# EAGLE design game board (EAGLE 7.2.0)
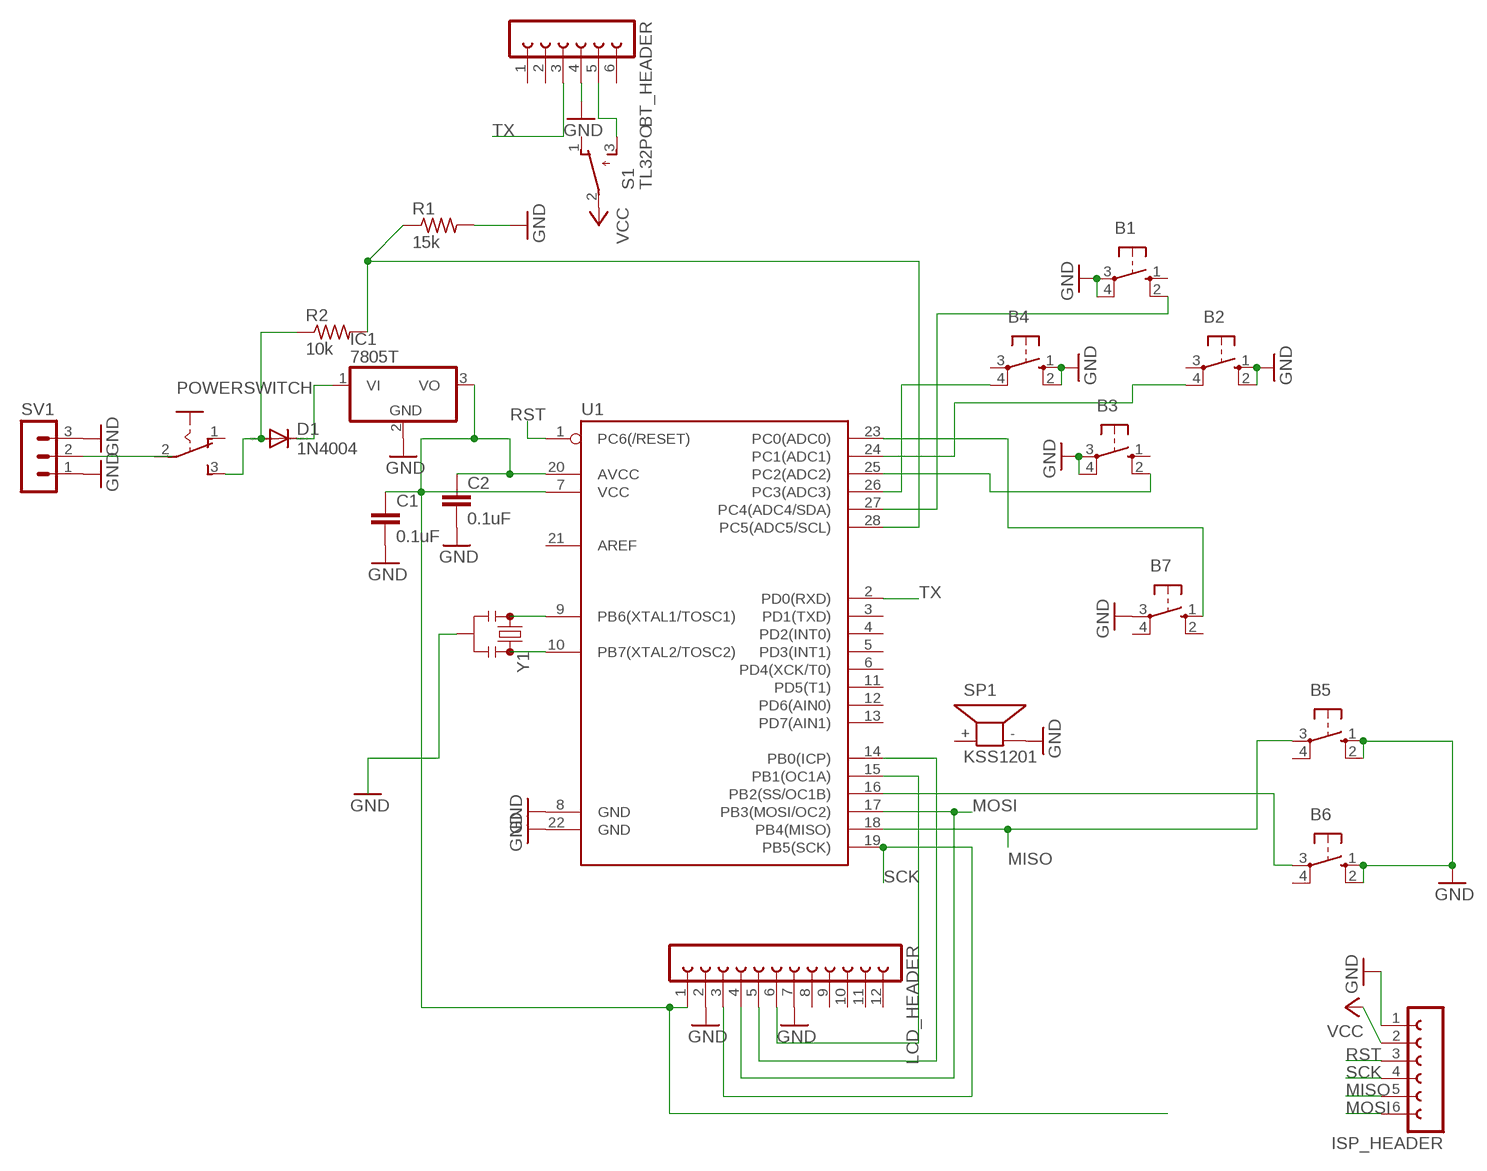
[diagram p0: schematic, sheet 1]

## Parts
B1  10-XX  [B3F-10XX]
B2  10-XX  [B3F-10XX]
B3  10-XX  [B3F-10XX]
B4  10-XX  [B3F-10XX]
B5  10-XX  [B3F-10XX]
B6  10-XX  [B3F-10XX]
B7  10-XX  [B3F-10XX]
BT_HEADER  FE06W  [FE06W]
C1  0.1uF  0.1UF-25V(+80/-20%)(0603)  [0603-CAP]
C2  0.1uF  0.1UF-25V(+80/-20%)(0603)  [0603-CAP]
D1  1N4004  [DO41-10]
IC1  7805T  [TO220H]
ISP_HEADER  FE06W  [FE06W]
LCD_HEADER  FE12W  [FE12W]
POWERSWITCH  M251  [M251]
R1  15k  R-US_0204/7  [0204/7]
R2  10k  R-US_0204/7  [0204/7]
S1  TL32PO  [TL3XPO]
SP1  KSS1201  [KSS1201]
SV1  MA03-1  [MA03-1]
U1  ATMEGA328P_PDIP  [DIL28-3]
Y1  RESONATORPTH  [RESONATOR-PTH]

## Nets
GND: B1.3(P) B1.4(P1) B2.1(S) B2.2(S1) B3.3(P) B3.4(P1) B4.1(S) B4.2(S1) B5.1(S) B5.2(S1) B6.1(S) B6.2(S1) B7.3(P) BT_HEADER.4 C1.2 C2.2 IC1.2(GND) ISP_HEADER.1 LCD_HEADER.2 LCD_HEADER.7 R1.2 SP1.- SV1.1 SV1.3 U1.8(GND) U1.22(GND) Y1.2
MISO: B5.3(P) ISP_HEADER.5 U1.18(PB4(MISO))
MOSI: ISP_HEADER.6 LCD_HEADER.4 U1.17(PB3(MOSI/OC2))
N$1: D1.C IC1.1(VI)
N$2: D1.A POWERSWITCH.3(S) R2.1
N$3: R1.1 R2.2 U1.28(PC5(ADC5/SCL))
N$4: B7.1(S) U1.23(PC0(ADC0))
N$5: B6.3(P) U1.16(PB2(SS/OC1B))
N$6: BT_HEADER.5 S1.3(S)
N$7: LCD_HEADER.5 U1.14(PB0(ICP))
N$8: B1.2(S1) U1.27(PC4(ADC4/SDA))
N$9: U1.9(PB6(XTAL1/TOSC1)) Y1.1
N$10: U1.10(PB7(XTAL2/TOSC2)) Y1.3
N$11: B2.4(P1) U1.24(PC1(ADC1))
N$12: B3.2(S1) U1.25(PC2(ADC2))
N$13: POWERSWITCH.2(P) SV1.2
N$14: LCD_HEADER.6 U1.15(PB1(OC1A))
N$15: B4.4(P1) U1.26(PC3(ADC3))
N$21: C1.1 C2.1 IC1.3(VO) LCD_HEADER.1 U1.7(VCC) U1.20(AVCC)
RST: ISP_HEADER.3 U1.1(PC6(/RESET))
SCK: ISP_HEADER.4 LCD_HEADER.3 U1.19(PB5(SCK))
TX: BT_HEADER.3 U1.2(PD0(RXD))
VCC: ISP_HEADER.2 S1.2(P)
Unconnected: B1.1(S) B2.3(P) B3.1(S) B4.3(P) B5.4(P1) B6.4(P1) B7.2(S1) B7.4(P1) BT_HEADER.1 BT_HEADER.2 BT_HEADER.6 LCD_HEADER.8 LCD_HEADER.9 LCD_HEADER.10 LCD_HEADER.11 LCD_HEADER.12 POWERSWITCH.1(O) S1.1(O) SP1.+ U1.3(PD1(TXD)) U1.4(PD2(INT0)) U1.5(PD3(INT1)) U1.6(PD4(XCK/T0)) U1.11(PD5(T1)) U1.12(PD6(AIN0)) U1.13(PD7(AIN1)) U1.21(AREF)

## Library data of the parts
B1-B7 = switch-omron:10-XX: OMRON SWITCH; MPN: B3F-1000; OC_FARNELL: 176432; OC_NEWARK: 36M3542
BT_HEADER ISP_HEADER = con-lsta:FE06W: FEMALE HEADER; OC_FARNELL: unknown; OC_NEWARK: unknown
C1 C2 = SparkFun-Capacitors:0.1UF-25V(+80/-20%)(0603): CAP-00810 Ceramic Standard decoupling cap; PROD_ID: CAP-00810
D1 = diode:1N4004: DIODE general purpose rectifier, 1 A
IC1 = linear:78*: Positive VOLTAGE REGULATOR Source: http://cache.national.com/ds/LM/LM78L05.pdf http://www.fairchildsemi.com/ds/LM/LM7805.pdf
LCD_HEADER = con-lsta:FE12W: FEMALE HEADER; OC_FARNELL: unknown; OC_NEWARK: unknown
POWERSWITCH = switch:M251: SLIDING SWITCH Mors, distributor Buerklin, 11G702
R1 R2 = resistor:R-US_: RESISTOR, American symbol
S1 = switch:TL32PO: TINY SWITCH ON - MOM Source: http://www2.produktinfo.conrad.com/datenblaetter/700000-724999/705152-da-01-de-Subminiaturschalter_TL_36YO.pdf
SP1 = buzzer:KSS1201: SPEAKER Source: Schukat; OC_FARNELL: unknown; OC_NEWARK: unknown
SV1 = con-lstb:MA03-1: PIN HEADER; OC_FARNELL: unknown; OC_NEWARK: unknown
U1 = SparkFun-DigitalIC:ATMEGA328P_PDIP: uC used in the Arduino 32kb flash, 1k EEPROM, 2k SRAM This is the through-hole version of this chip.
Y1 = SparkFun-FreqCtrl:RESONATOR: Resonator Small SMD resonator. Used, eg, on the Arduino Pro/ Pro Mini boards. 8MHz- XTAL-08895 16MHz- XTAL-08900

## Board
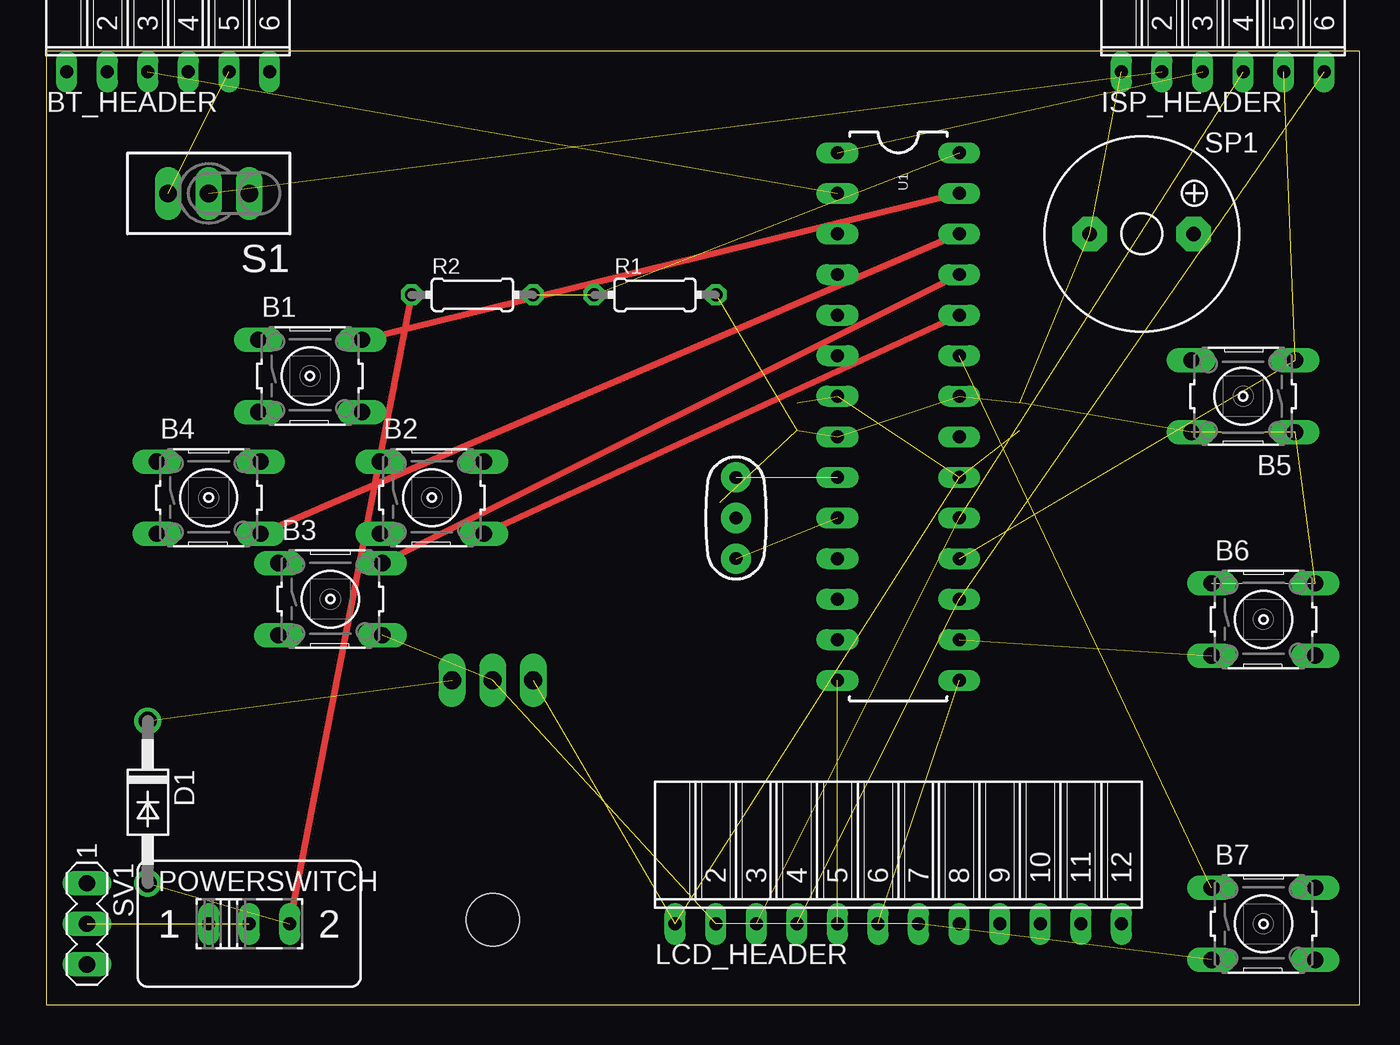
[diagram p1: board, top side]
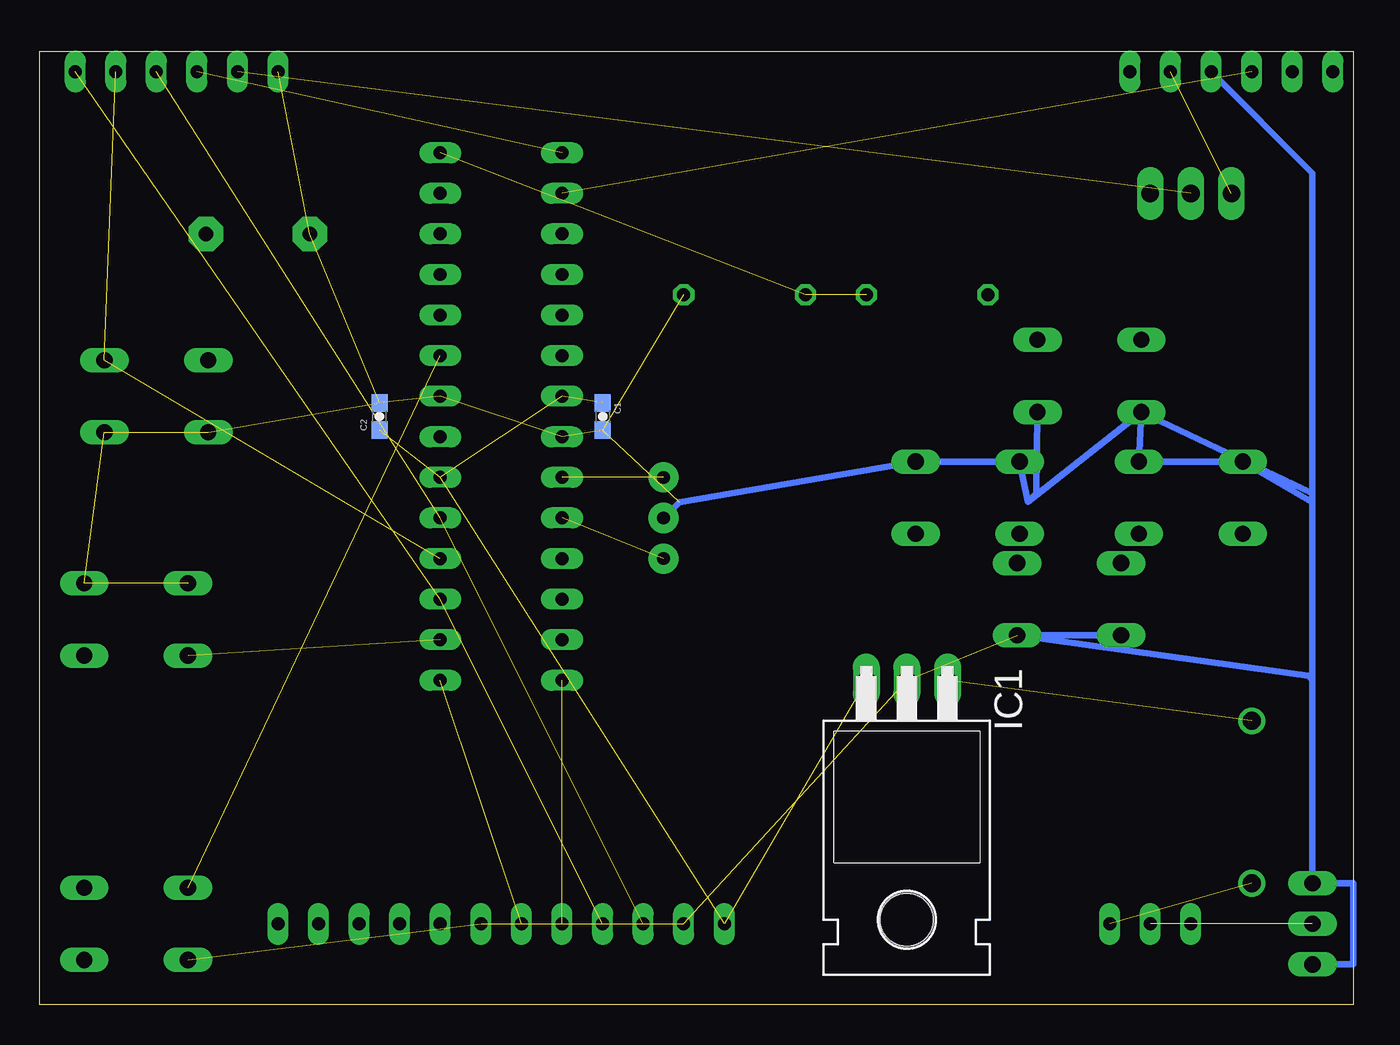
[diagram p2: board, bottom side, seen from below]

Size 82.22 x 59.68 mm. Coordinates in mm from the lower left corner, seen from the top.
Outline: 0,0 82.22,0 82.22,59.68 0,59.68 0,0
Copper layers (1*16): Top 0.035mm / dielectric 1.5mm / Bottom 0.035mm
Design rules "default": minimum track width 10mil, minimum drill 24mil, track to track 8mil, track to pad 8mil, pad to pad 8mil, via to via 8mil, smd to smd 8mil, copper to edge 40mil, drill to drill 8mil, minimum pad ring 10mil, minimum via ring 8mil, stop-mask expansion 4mil, vias tented up to drill 0mil, thermal gap 10mil

### Footprints (pad centres in the part's own frame; a part is rotated, then mirrored left to right if it is on the bottom)
B3F-10XX = drill 1.016 long: 1 -3.251,2.261; 2 3.251,2.261; 3 -3.251,-2.261; 4 3.251,-2.261
FE06W = drill 0.813 long: 1 -6.35,0; 2 -3.81,0; 3 -1.27,0; 4 1.27,0; 5 3.81,0; 6 6.35,0
0603-CAP = smd 1.1 x 1: 1 -0.85,0; 2 0.85,0
DO41-10 = drill 1.118: A 5.08,0; C -5.08,0
TO220H = drill 1.118 long: 1 -2.54,-10.16; 2 0,-10.16; 3 2.54,-10.16 | hole 3.302: 0,4.826
FE12W = drill 0.813 long: 1 -13.97,0; 2 -11.43,0; 3 -8.89,0; 4 -6.35,0; 5 -3.81,0; 6 -1.27,0; 7 1.27,0; 8 3.81,0; 9 6.35,0; 10 8.89,0; 11 11.43,0; 12 13.97,0
M251 = drill 0.813 long: 1 -2.54,0; 2 0,0; 3 2.54,0
0204/7 = drill 0.813 octagon: 1 -3.81,0; 2 3.81,0
TL3XPO = drill 1.1 pad 1.422 long: 1 -2.54,0; 2 0,0; 3 2.54,0
KSS1201 = drill 0.914 pad 2.159 octagon: + 3.251,0; - -3.251,0
MA03-1 = drill 1.016 long: 1 -2.54,0; 2 0,0; 3 2.54,0
DIL28-3 = drill 0.813 long: 1 -16.51,-3.81; 2 -13.97,-3.81; 3 -11.43,-3.81; 4 -8.89,-3.81; 5 -6.35,-3.81; 6 -3.81,-3.81; 7 -1.27,-3.81; 8 1.27,-3.81; 9 3.81,-3.81; 10 6.35,-3.81; 11 8.89,-3.81; 12 11.43,-3.81; 13 13.97,-3.81; 14 16.51,-3.81; 15 16.51,3.81; 16 13.97,3.81; 17 11.43,3.81; 18 8.89,3.81; 19 6.35,3.81; 20 3.81,3.81; 21 1.27,3.81; 22 -1.27,3.81; 23 -3.81,3.81; 24 -6.35,3.81; 25 -8.89,3.81; 26 -11.43,3.81; 27 -13.97,3.81; 28 -16.51,3.81
RESONATOR-PTH = drill 0.8 pad 1.88: 1 -2.54,0; 2 0,0; 3 2.54,0

### Placement (x,y rotation side)
B1  16.51,39.37 0 top
B2  24.13,31.75 0 top
B3  17.78,25.4 0 top
B4  10.16,31.75 0 top
B5  74.93,38.1 180 top
B6  76.2,24.13 0 top
B7  76.2,5.08 0 top
BT_HEADER  7.62,58.42 0 top
C1  46.99,36.83 270 bottom
C2  60.96,36.83 90 bottom
D1  6.35,12.7 270 top
IC1  27.94,10.16 180 bottom
ISP_HEADER  73.66,58.42 0 top
LCD_HEADER  53.34,5.08 0 top
POWERSWITCH  12.7,5.08 0 top
R1  38.1,44.45 0 top
R2  26.67,44.45 0 top
S1  10.16,50.8 180 top
SP1  68.58,48.26 0 top
SV1  2.54,5.08 270 top
U1  53.34,36.83 270 top
Y1  43.18,30.48 270 top

### Tracks (layer width: path | path; a pad name or v marks a point on that pad's centre or on a via)
GND  (15 unrouted)
  Bottom 0.406: B1.3 20.38,31.5 | 20.38,31.5 B2.1 B2.2 42.19,31.47 Y1.2 | B1.3 B4.2 B4.1 2.54,31.47 | B1.3 2.54,32.03 2.54,30.48 | 2.54,31.47 2.54,20.32 | SV1.3 0,2.54 0,7.62 SV1.1 2.54,20.32 | 2.54,31.47 2.54,52.07 BT_HEADER.4 | B1.4 19.84,32.03 20.38,31.5 | B3.3 B3.4 2.82,20.6 2.54,20.32
MISO  (2 unrouted)
MOSI  (2 unrouted)
N$1  (1 unrouted)
N$2  (1 unrouted)
  Top 0.406: R2.1 POWERSWITCH.3
N$3  (2 unrouted)
N$4  (1 unrouted)
N$5  (1 unrouted)
N$6  (1 unrouted)
N$7  (1 unrouted)
N$8
  Top 0.406: B1.2 U1.27
N$9  (1 unrouted)
N$10  (1 unrouted)
N$11
  Top 0.406: B2.4 U1.24
N$12
  Top 0.406: B3.2 U1.25
N$13  (1 unrouted)
N$14  (1 unrouted)
N$15
  Top 0.406: B4.4 U1.26
N$21  (5 unrouted)
RST  (1 unrouted)
SCK  (2 unrouted)
TX  (1 unrouted)
VCC  (1 unrouted)